# Altium schematic sheet TopSheet.SchDoc
size B
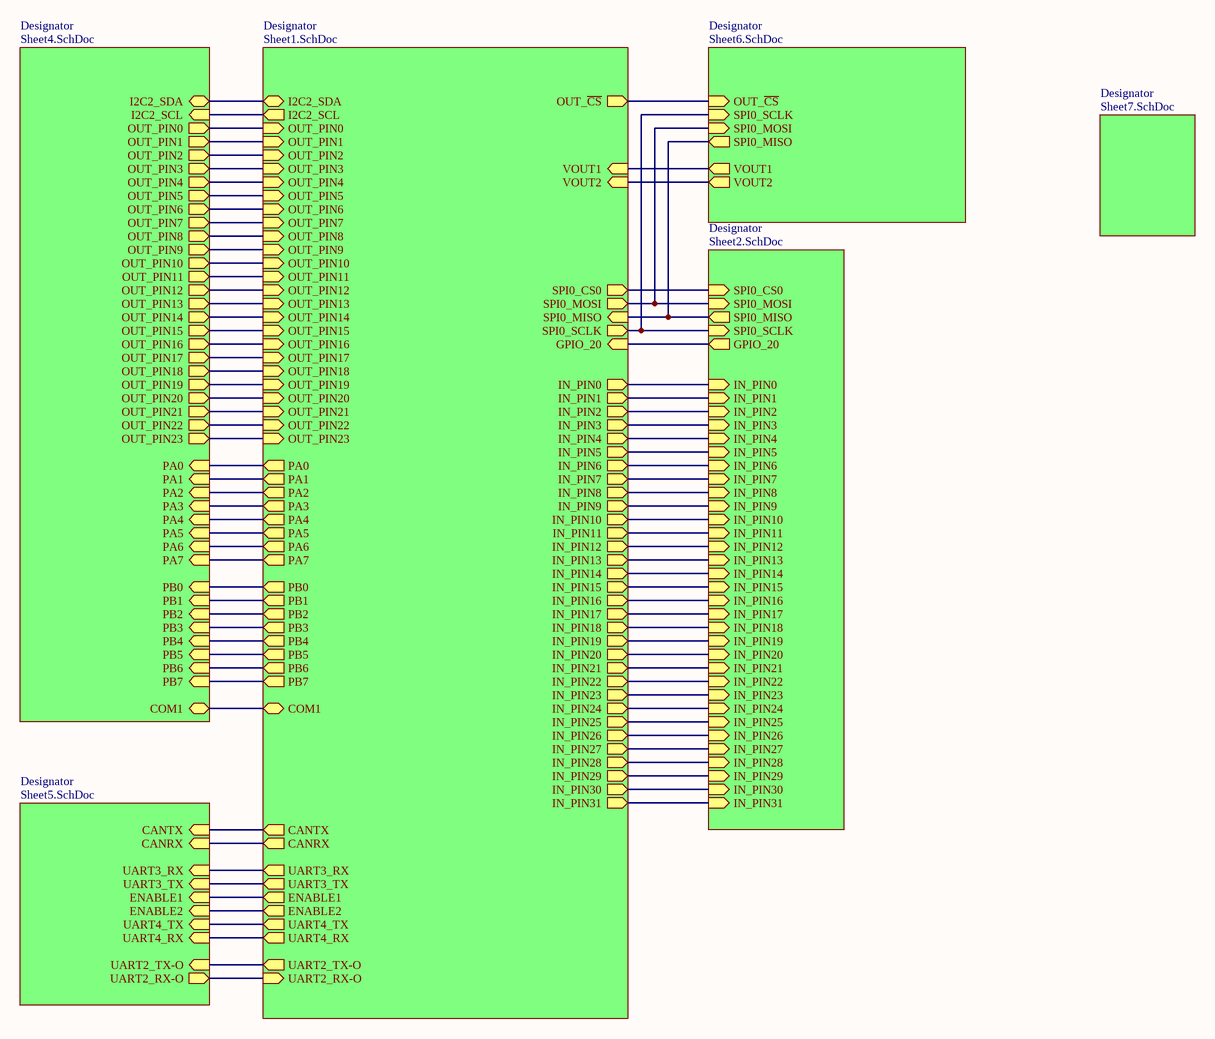
[diagram p0: TopSheet.SchDoc]

## Sub-sheets
Designator = Sheet1.SchDoc: OUT_PIN0 (in), OUT_PIN1 (in), OUT_PIN2 (in), OUT_PIN3 (in), OUT_PIN4 (in), OUT_PIN5 (in), OUT_PIN6 (in), OUT_PIN7 (in), OUT_PIN8 (in), OUT_PIN9 (in), OUT_PIN10 (in), OUT_PIN11 (in), OUT_PIN12 (in), OUT_PIN13 (in), OUT_PIN14 (in), OUT_PIN15 (in), SPI0_CS0 (out), SPI0_MOSI (out), SPI0_MISO (in), SPI0_SCLK (out), I2C2_SCL (out), I2C2_SDA (bidir), OUT_~{CS} (out), VOUT1 (in), VOUT2 (in), OUT_PIN16 (in), OUT_PIN17 (in), OUT_PIN18 (in), OUT_PIN19 (in), OUT_PIN20 (in), OUT_PIN21 (in), OUT_PIN22 (in), OUT_PIN23 (in), PA0 (out), PA1 (out), PA2 (out), PA3 (out), PA4 (out), PA5 (out), PA6 (out), PA7 (out), PB0 (out), PB1 (out), PB2 (out), PB3 (out), PB4 (out), PB5 (out), PB6 (out), PB7 (out), GPIO_20 (in), IN_PIN0 (out), IN_PIN1 (out), IN_PIN2 (out), IN_PIN3 (out), IN_PIN4 (out), IN_PIN5 (out), IN_PIN6 (out), IN_PIN7 (out), IN_PIN8 (out), IN_PIN9 (out), IN_PIN10 (out), IN_PIN11 (out), IN_PIN12 (out), IN_PIN13 (out), IN_PIN14 (out), IN_PIN15 (out), IN_PIN16 (out), IN_PIN17 (out), IN_PIN18 (out), IN_PIN19 (out), IN_PIN20 (out), IN_PIN21 (out), IN_PIN22 (out), IN_PIN23 (out), IN_PIN24 (out), IN_PIN25 (out), IN_PIN26 (out), IN_PIN27 (out), IN_PIN28 (out), IN_PIN29 (out), IN_PIN30 (out), IN_PIN31 (out), CANTX (out), CANRX (out), UART3_RX (out), UART3_TX (out), ENABLE1 (out), ENABLE2 (out), UART4_TX (out), UART4_RX (out), UART2_TX-O (out), UART2_RX-O (in), COM1 (bidir)
Designator = Sheet2.SchDoc: SPI0_CS0 (in), GPIO_20 (out), SPI0_SCLK (in), SPI0_MISO (out), SPI0_MOSI (in), IN_PIN0 (in), IN_PIN1 (in), IN_PIN2 (in), IN_PIN3 (in), IN_PIN4 (in), IN_PIN5 (in), IN_PIN6 (in), IN_PIN7 (in), IN_PIN8 (in), IN_PIN9 (in), IN_PIN10 (in), IN_PIN11 (in), IN_PIN12 (in), IN_PIN13 (in), IN_PIN14 (in), IN_PIN15 (in), IN_PIN16 (in), IN_PIN17 (in), IN_PIN18 (in), IN_PIN19 (in), IN_PIN20 (in), IN_PIN21 (in), IN_PIN22 (in), IN_PIN23 (in), IN_PIN24 (in), IN_PIN25 (in), IN_PIN26 (in), IN_PIN27 (in), IN_PIN28 (in), IN_PIN29 (in), IN_PIN30 (in), IN_PIN31 (in)
Designator = Sheet4.SchDoc: I2C2_SDA (bidir), I2C2_SCL (in), OUT_PIN0 (out), OUT_PIN1 (out), OUT_PIN2 (out), OUT_PIN3 (out), OUT_PIN4 (out), OUT_PIN5 (out), OUT_PIN6 (out), OUT_PIN7 (out), OUT_PIN8 (out), OUT_PIN9 (out), OUT_PIN10 (out), OUT_PIN11 (out), OUT_PIN12 (out), OUT_PIN13 (out), OUT_PIN14 (out), OUT_PIN15 (out), OUT_PIN16 (out), OUT_PIN17 (out), OUT_PIN18 (out), OUT_PIN19 (out), OUT_PIN20 (out), OUT_PIN21 (out), OUT_PIN22 (out), OUT_PIN23 (out), PA0 (in), PA1 (in), PA2 (in), PA3 (in), PA4 (in), PA5 (in), PA6 (in), PA7 (in), PB0 (in), PB1 (in), PB2 (in), PB3 (in), PB4 (in), PB5 (in), PB6 (in), PB7 (in), COM1 (bidir)
Designator = Sheet5.SchDoc: CANTX (in), CANRX (in), UART3_RX (in), UART3_TX (in), ENABLE1 (in), ENABLE2 (in), UART4_TX (in), UART4_RX (in), UART2_TX-O (in), UART2_RX-O (out)
Designator = Sheet6.SchDoc: OUT_~{CS} (in), SPI0_SCLK (in), SPI0_MOSI (in), SPI0_MISO (out), VOUT1 (out), VOUT2 (out)
Designator = Sheet7.SchDoc: no entries

## Nets
(unnamed): sheet Designator/OUT_PIN0, sheet Designator/OUT_PIN0
(unnamed): sheet Designator/OUT_PIN1, sheet Designator/OUT_PIN1
(unnamed): sheet Designator/OUT_PIN2, sheet Designator/OUT_PIN2
(unnamed): sheet Designator/OUT_PIN3, sheet Designator/OUT_PIN3
(unnamed): sheet Designator/OUT_PIN4, sheet Designator/OUT_PIN4
(unnamed): sheet Designator/OUT_PIN5, sheet Designator/OUT_PIN5
(unnamed): sheet Designator/OUT_PIN6, sheet Designator/OUT_PIN6
(unnamed): sheet Designator/OUT_PIN7, sheet Designator/OUT_PIN7
(unnamed): sheet Designator/OUT_PIN8, sheet Designator/OUT_PIN8
(unnamed): sheet Designator/OUT_PIN9, sheet Designator/OUT_PIN9
(unnamed): sheet Designator/OUT_PIN10, sheet Designator/OUT_PIN10
(unnamed): sheet Designator/OUT_PIN11, sheet Designator/OUT_PIN11
(unnamed): sheet Designator/OUT_PIN12, sheet Designator/OUT_PIN12
(unnamed): sheet Designator/OUT_PIN13, sheet Designator/OUT_PIN13
(unnamed): sheet Designator/OUT_PIN14, sheet Designator/OUT_PIN14
(unnamed): sheet Designator/OUT_PIN15, sheet Designator/OUT_PIN15
(unnamed): sheet Designator/SPI0_CS0, sheet Designator/SPI0_CS0
(unnamed): sheet Designator/SPI0_MOSI, sheet Designator/SPI0_MOSI, sheet Designator/SPI0_MOSI
(unnamed): sheet Designator/SPI0_MISO, sheet Designator/SPI0_MISO, sheet Designator/SPI0_MISO
(unnamed): sheet Designator/SPI0_SCLK, sheet Designator/SPI0_SCLK, sheet Designator/SPI0_SCLK
(unnamed): sheet Designator/I2C2_SCL, sheet Designator/I2C2_SCL
(unnamed): sheet Designator/I2C2_SDA, sheet Designator/I2C2_SDA
(unnamed): sheet Designator/OUT_~{CS}, sheet Designator/OUT_~{CS}
(unnamed): sheet Designator/VOUT1, sheet Designator/VOUT1
(unnamed): sheet Designator/VOUT2, sheet Designator/VOUT2
(unnamed): sheet Designator/OUT_PIN16, sheet Designator/OUT_PIN16
(unnamed): sheet Designator/OUT_PIN17, sheet Designator/OUT_PIN17
(unnamed): sheet Designator/OUT_PIN18, sheet Designator/OUT_PIN18
(unnamed): sheet Designator/OUT_PIN19, sheet Designator/OUT_PIN19
(unnamed): sheet Designator/OUT_PIN20, sheet Designator/OUT_PIN20
(unnamed): sheet Designator/OUT_PIN21, sheet Designator/OUT_PIN21
(unnamed): sheet Designator/OUT_PIN22, sheet Designator/OUT_PIN22
(unnamed): sheet Designator/OUT_PIN23, sheet Designator/OUT_PIN23
(unnamed): sheet Designator/PA0, sheet Designator/PA0
(unnamed): sheet Designator/PA1, sheet Designator/PA1
(unnamed): sheet Designator/PA2, sheet Designator/PA2
(unnamed): sheet Designator/PA3, sheet Designator/PA3
(unnamed): sheet Designator/PA4, sheet Designator/PA4
(unnamed): sheet Designator/PA5, sheet Designator/PA5
(unnamed): sheet Designator/PA6, sheet Designator/PA6
(unnamed): sheet Designator/PA7, sheet Designator/PA7
(unnamed): sheet Designator/PB0, sheet Designator/PB0
(unnamed): sheet Designator/PB1, sheet Designator/PB1
(unnamed): sheet Designator/PB2, sheet Designator/PB2
(unnamed): sheet Designator/PB3, sheet Designator/PB3
(unnamed): sheet Designator/PB4, sheet Designator/PB4
(unnamed): sheet Designator/PB5, sheet Designator/PB5
(unnamed): sheet Designator/PB6, sheet Designator/PB6
(unnamed): sheet Designator/PB7, sheet Designator/PB7
(unnamed): sheet Designator/GPIO_20, sheet Designator/GPIO_20
(unnamed): sheet Designator/IN_PIN0, sheet Designator/IN_PIN0
(unnamed): sheet Designator/IN_PIN1, sheet Designator/IN_PIN1
(unnamed): sheet Designator/IN_PIN2, sheet Designator/IN_PIN2
(unnamed): sheet Designator/IN_PIN3, sheet Designator/IN_PIN3
(unnamed): sheet Designator/IN_PIN4, sheet Designator/IN_PIN4
(unnamed): sheet Designator/IN_PIN5, sheet Designator/IN_PIN5
(unnamed): sheet Designator/IN_PIN6, sheet Designator/IN_PIN6
(unnamed): sheet Designator/IN_PIN7, sheet Designator/IN_PIN7
(unnamed): sheet Designator/IN_PIN8, sheet Designator/IN_PIN8
(unnamed): sheet Designator/IN_PIN9, sheet Designator/IN_PIN9
(unnamed): sheet Designator/IN_PIN10, sheet Designator/IN_PIN10
(unnamed): sheet Designator/IN_PIN11, sheet Designator/IN_PIN11
(unnamed): sheet Designator/IN_PIN12, sheet Designator/IN_PIN12
(unnamed): sheet Designator/IN_PIN13, sheet Designator/IN_PIN13
(unnamed): sheet Designator/IN_PIN14, sheet Designator/IN_PIN14
(unnamed): sheet Designator/IN_PIN15, sheet Designator/IN_PIN15
(unnamed): sheet Designator/IN_PIN16, sheet Designator/IN_PIN16
(unnamed): sheet Designator/IN_PIN17, sheet Designator/IN_PIN17
(unnamed): sheet Designator/IN_PIN18, sheet Designator/IN_PIN18
(unnamed): sheet Designator/IN_PIN19, sheet Designator/IN_PIN19
(unnamed): sheet Designator/IN_PIN20, sheet Designator/IN_PIN20
(unnamed): sheet Designator/IN_PIN21, sheet Designator/IN_PIN21
(unnamed): sheet Designator/IN_PIN22, sheet Designator/IN_PIN22
(unnamed): sheet Designator/IN_PIN23, sheet Designator/IN_PIN23
(unnamed): sheet Designator/IN_PIN24, sheet Designator/IN_PIN24
(unnamed): sheet Designator/IN_PIN25, sheet Designator/IN_PIN25
(unnamed): sheet Designator/IN_PIN26, sheet Designator/IN_PIN26
(unnamed): sheet Designator/IN_PIN27, sheet Designator/IN_PIN27
(unnamed): sheet Designator/IN_PIN28, sheet Designator/IN_PIN28
(unnamed): sheet Designator/IN_PIN29, sheet Designator/IN_PIN29
(unnamed): sheet Designator/IN_PIN30, sheet Designator/IN_PIN30
(unnamed): sheet Designator/IN_PIN31, sheet Designator/IN_PIN31
(unnamed): sheet Designator/CANTX, sheet Designator/CANTX
(unnamed): sheet Designator/CANRX, sheet Designator/CANRX
(unnamed): sheet Designator/UART3_RX, sheet Designator/UART3_RX
(unnamed): sheet Designator/UART3_TX, sheet Designator/UART3_TX
(unnamed): sheet Designator/ENABLE1, sheet Designator/ENABLE1
(unnamed): sheet Designator/ENABLE2, sheet Designator/ENABLE2
(unnamed): sheet Designator/UART4_TX, sheet Designator/UART4_TX
(unnamed): sheet Designator/UART4_RX, sheet Designator/UART4_RX
(unnamed): sheet Designator/UART2_TX-O, sheet Designator/UART2_TX-O
(unnamed): sheet Designator/UART2_RX-O, sheet Designator/UART2_RX-O
(unnamed): sheet Designator/COM1, sheet Designator/COM1